# EAGLE schematic Schaltplan (Eagle-Format) (EAGLE 9.1.0)
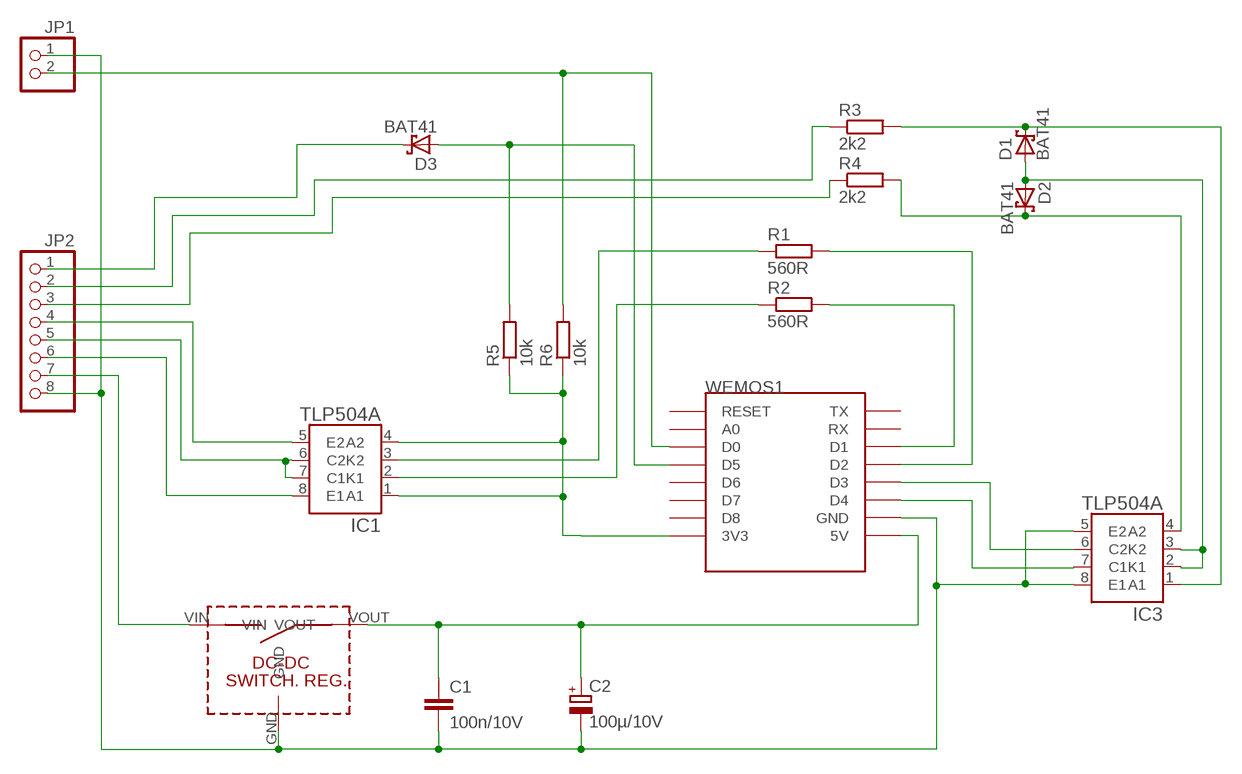
[diagram p0: schematic, sheet 1]

## Parts
C1  100n/10V  C2.5/2  [C2.5-2]
C2  100µ/10V  CPOL-EUE2.5-6  [E2,5-6]
D1  BAT41  SCHOTTKY-DIODEDO35-7  [DO35-7]
D2  BAT41  SCHOTTKY-DIODEDO35-7  [DO35-7]
D3  BAT41  SCHOTTKY-DIODEDO35-7  [DO35-7]
IC1  TLP504A  TLP504A_2  [DIL8_2]
IC3  TLP504A  TLP504A_2  [DIL8_2]
JP1  PINHD-1X2  [1X02]
JP2  PINHD-1X8  [1X08]
R1  560R  R-EU_0204/5  [0204/5]
R2  560R  R-EU_0204/5  [0204/5]
R3  2k2  R-EU_0204/5  [0204/5]
R4  2k2  R-EU_0204/5  [0204/5]
R5  10k  R-EU_0204/5  [0204/5]
R6  10k  R-EU_0204/5  [0204/5]
R78E5.0-0.5  R-78E5.0-0.5  R-78ER-78E5  [R-78E5]
WEMOS1  WEMOS-D1-MINI  [WEMOS-D1-MINI]

## Nets
N$1: IC1.2(K1) R2.1
N$2: IC1.3(K2) R1.1
N$3: R2.2 WEMOS1.D1
N$4: R1.2 WEMOS1.D2
N$5: IC3.6(C2) WEMOS1.D3
N$6: IC3.7(C1) WEMOS1.D4
N$7: C1.1 C2.+ R78E5.0-0.5.VOUT WEMOS1.5V
N$8: JP2.7 R78E5.0-0.5.VIN
N$9: C1.2 C2.- IC3.8(E1) JP1.1 JP2.8 R78E5.0-0.5.GND WEMOS1.GND
N$11: JP1.2 R6.2 WEMOS1.D0
N$12: D1.A D2.A IC3.2(K1) IC3.3(K2)
N$13: D1.C IC3.1(A1) R3.2
N$14: D2.C IC3.4(A2) R4.2
N$15: JP2.3 R4.1
N$16: JP2.2 R3.1
N$17: D3.C JP2.1
N$18: D3.A R5.2 WEMOS1.D5
N$19: IC1.1(A1) IC1.4(A2) R5.1 R6.1 WEMOS1.3V3
N$20: IC3.5(E2)
N$21: IC1.5(E2) JP2.4
N$22: IC1.6(C2) JP2.5
N$23: IC1.7(C1)
N$24: IC1.8(E1) JP2.6
Unconnected: WEMOS1.A0 WEMOS1.D6 WEMOS1.D7 WEMOS1.D8 WEMOS1.RESET WEMOS1.RX WEMOS1.TX

## Library data of the parts
C1 = capacitor-wima:C: CAPACITOR naming: grid - package width
C2 = Clean-Kong:CPOL-EU: POLARIZED CAPACITOR, European symbol
D1-D3 = diode:SCHOTTKY-DIODE: Schottky Diode; SPICEPREFIX: D
IC1 IC3 = TARGET3001!_V20.3.0.47:TLP504A_2: Optokoppler, 4N.../6N.../TLP..., Optokoppler, TLP 504A [DIL8]
JP1 = pinhead:PINHD-1X2: PIN HEADER
JP2 = pinhead:PINHD-1X8: PIN HEADER
R1-R6 = resistor:R-EU_: RESISTOR, European symbol
R78E5.0-0.5 = Clean-Kong:R-78E: R-78E serie from Recon International : http://docs-europe.electrocomponents.com/webdocs/10a2/0900766b810a2db7.pdf; SPICEPREFIX: X
WEMOS1 = esp8266modules:WEMOS-D1-MINI: WeMos.cc D1 mini ESP8266 module